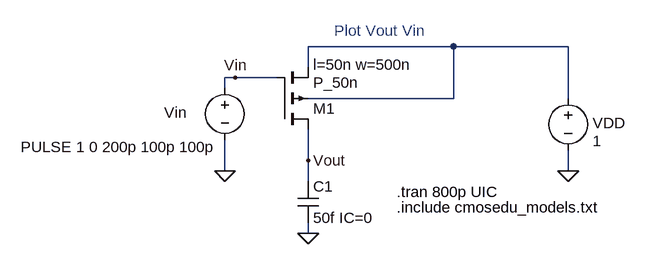
[diagram p0: schematic Fig10_12_PMOS_short.asc]
Fig10_12_PMOS_short.asc, the LTspice schematic file:
Version 4
SHEET 1 1224 688
WIRE 672 80 448 80
WIRE 848 80 672 80
WIRE 448 112 448 80
WIRE 336 128 320 128
WIRE 400 128 336 128
WIRE 320 144 320 128
WIRE 672 160 672 80
WIRE 672 160 448 160
WIRE 848 160 848 80
WIRE 448 256 448 208
WIRE 320 272 320 224
WIRE 848 272 848 240
WIRE 448 288 448 256
WIRE 448 368 448 352
FLAG 848 272 0
FLAG 320 272 0
FLAG 336 128 Vin
FLAG 448 368 0
FLAG 448 256 Vout
SYMBOL voltage 320 128 R0
WINDOW 0 -93 54 Left 2
WINDOW 3 -314 107 Left 2
WINDOW 123 0 0 Left 2
WINDOW 39 0 0 Left 2
SYMATTR InstName Vin
SYMATTR Value PULSE 1 0 200p 100p 100p
SYMBOL pmos4 400 208 M180
WINDOW 123 56 100 Left 2
SYMATTR Value2 l=50n w=500n
SYMATTR InstName M1
SYMATTR Value P_50n
SYMBOL voltage 848 144 R0
WINDOW 123 0 0 Left 2
WINDOW 39 0 0 Left 2
WINDOW 0 38 54 Left 2
WINDOW 3 38 82 Left 2
SYMATTR InstName VDD
SYMATTR Value 1
SYMBOL cap 432 288 R0
SYMATTR InstName C1
SYMATTR Value 50f IC=0
TEXT 584 304 Left 2 !.tran 800p UIC
TEXT 584 328 Left 2 !.include cmosedu_models.txt
TEXT 488 56 Left 2 ;Plot Vout Vin

The netlist it stands for:
* Fig10_12_PMOS_short.asc
Vin Vin 0 PULSE 1 0 200p 100p 100p
M1 Vout Vin N001 N001 P_50n l=50n w=500n
VDD N001 0 1
C1 Vout 0 50f IC=0
.model NMOS NMOS
.model PMOS PMOS
.lib standard.mos
.tran 800p UIC
.include cmosedu_models.txt
* Plot Vout Vin
.backanno
.end